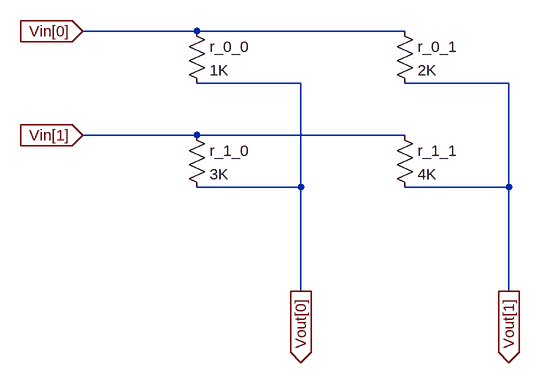
[diagram p0: schematic crossbar.asc]
crossbar.asc, the LTspice schematic file:
Version 4
SHEET 1 2360 680
WIRE 16 16 -160 16
WIRE 336 16 16 16
WIRE 176 96 16 96
WIRE 496 96 336 96
WIRE 16 176 -160 176
WIRE 336 176 16 176
WIRE 176 256 176 96
WIRE 176 256 16 256
WIRE 496 256 496 96
WIRE 496 256 336 256
WIRE 176 416 176 256
WIRE 496 416 496 256
FLAG -160 16 Vin[0]
IOPIN -160 16 In
FLAG -160 176 Vin[1]
IOPIN -160 176 In
FLAG 176 416 Vout[0]
IOPIN 176 416 Out
FLAG 496 416 Vout[1]
IOPIN 496 416 Out
SYMBOL res 0 0 R0
SYMATTR InstName r_0_0
SYMATTR Value 1K
SYMBOL res 320 0 R0
SYMATTR InstName r_0_1
SYMATTR Value 2K
SYMBOL res 0 160 R0
SYMATTR InstName r_1_0
SYMATTR Value 3K
SYMBOL res 320 160 R0
SYMATTR InstName r_1_1
SYMATTR Value 4K

The netlist it stands for:
* crossbar.asc
r_0_0 Vin[0] Vout[0] 1K
r_0_1 Vin[0] Vout[1] 2K
r_1_0 Vin[1] Vout[0] 3K
r_1_1 Vin[1] Vout[1] 4K
.backanno
.end